# Altium schematic sheet grup komponent.SchDoc
size A4
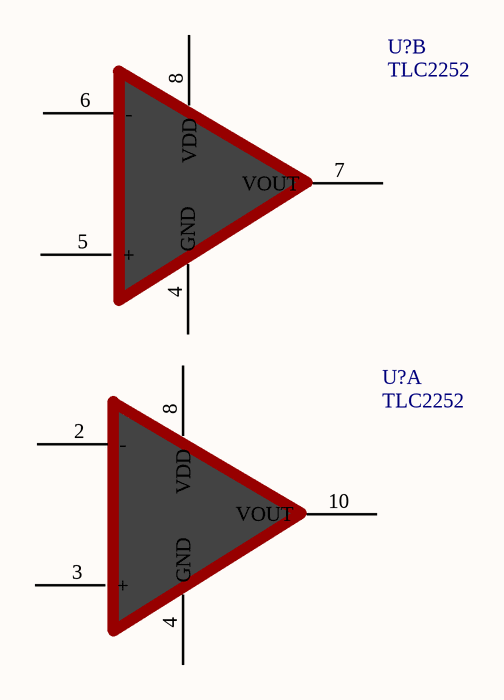
[diagram p0: grup komponent.SchDoc]

## Parts
(Parts that share a designator on the sheet are numbered #1, #2 ... from top to bottom, then left to right.)
U?#1  TLC2252  (part B of 3)
U?#2  TLC2252  (part A of 3)

## Nets

Not connected (* = marked no-connect by the designer): U?#1 4(GND) 5(+) 6(-) 7(VOUT) 8(VDD); U?#2 2(-) 3(+) 4(GND) 8(VDD) 10(VOUT)